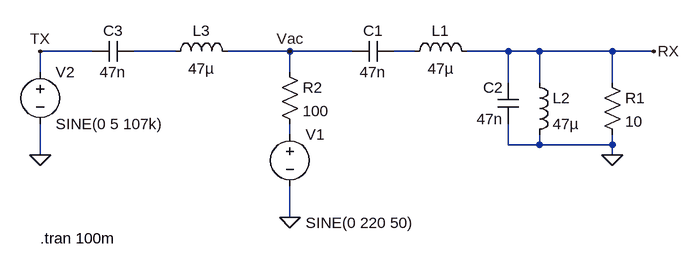
[diagram p0: schematic LC_Band_Pass_Filter_test.asc]
LC_Band_Pass_Filter_test.asc, the LTspice schematic file:
Version 4
SHEET 1 880 680
WIRE -320 48 -400 48
WIRE -192 48 -256 48
WIRE -16 48 -112 48
WIRE 80 48 -16 48
WIRE 176 48 144 48
WIRE 320 48 256 48
WIRE 368 48 320 48
WIRE 480 48 368 48
WIRE 544 48 480 48
WIRE -400 80 -400 48
WIRE -16 80 -16 48
WIRE 320 96 320 48
WIRE 368 96 368 48
WIRE 480 96 480 48
WIRE -16 176 -16 160
WIRE 320 192 320 160
WIRE 368 192 368 176
WIRE 368 192 320 192
WIRE 480 192 480 176
WIRE 480 192 368 192
WIRE -400 208 -400 160
WIRE 480 208 480 192
WIRE -16 304 -16 256
FLAG -16 304 0
FLAG 480 208 0
FLAG -400 208 0
FLAG -400 48 TX
FLAG 544 48 RX
FLAG -16 48 Vac
SYMBOL voltage -16 160 R0
WINDOW 123 24 124 Left 2
WINDOW 39 0 0 Left 0
WINDOW 3 24 152 Left 2
SYMATTR Value SINE(0 220 50)
SYMATTR InstName V1
SYMBOL cap 144 32 R90
WINDOW 0 0 32 VBottom 2
WINDOW 3 32 32 VTop 2
SYMATTR InstName C1
SYMATTR Value 47n
SYMBOL cap 336 160 R180
WINDOW 0 24 56 Left 2
WINDOW 3 24 8 Left 2
SYMATTR InstName C2
SYMATTR Value 47n
SYMBOL ind 160 64 R270
WINDOW 0 32 56 VTop 2
WINDOW 3 5 56 VBottom 2
SYMATTR InstName L1
SYMATTR Value 47µ
SYMBOL ind 352 80 R0
SYMATTR InstName L2
SYMATTR Value 47µ
SYMBOL res 464 80 R0
SYMATTR InstName R1
SYMATTR Value 10
SYMBOL cap -256 32 R90
WINDOW 0 0 32 VBottom 2
WINDOW 3 32 32 VTop 2
SYMATTR InstName C3
SYMATTR Value 47n
SYMBOL ind -208 64 R270
WINDOW 0 32 56 VTop 2
WINDOW 3 5 56 VBottom 2
SYMATTR InstName L3
SYMATTR Value 47µ
SYMBOL voltage -400 64 R0
WINDOW 123 0 0 Left 0
WINDOW 39 0 0 Left 0
SYMATTR InstName V2
SYMATTR Value SINE(0 5 107k)
SYMBOL res -32 64 R0
SYMATTR InstName R2
SYMATTR Value 100
TEXT -400 336 Left 2 !.tran 100m

The netlist it stands for:
* LC_Band_Pass_Filter_test.asc
V1 N003 0 SINE(0 220 50)
C1 N002 Vac 47n
C2 0 RX 47n
L1 N002 RX 47µ
L2 RX 0 47µ
R1 RX 0 10
C3 N001 TX 47n
L3 N001 Vac 47µ
V2 TX 0 SINE(0 5 107k)
R2 Vac N003 100
.tran 100m
.backanno
.end